# EAGLE design ECE4180_DP_Main (EAGLE 9.2.2)
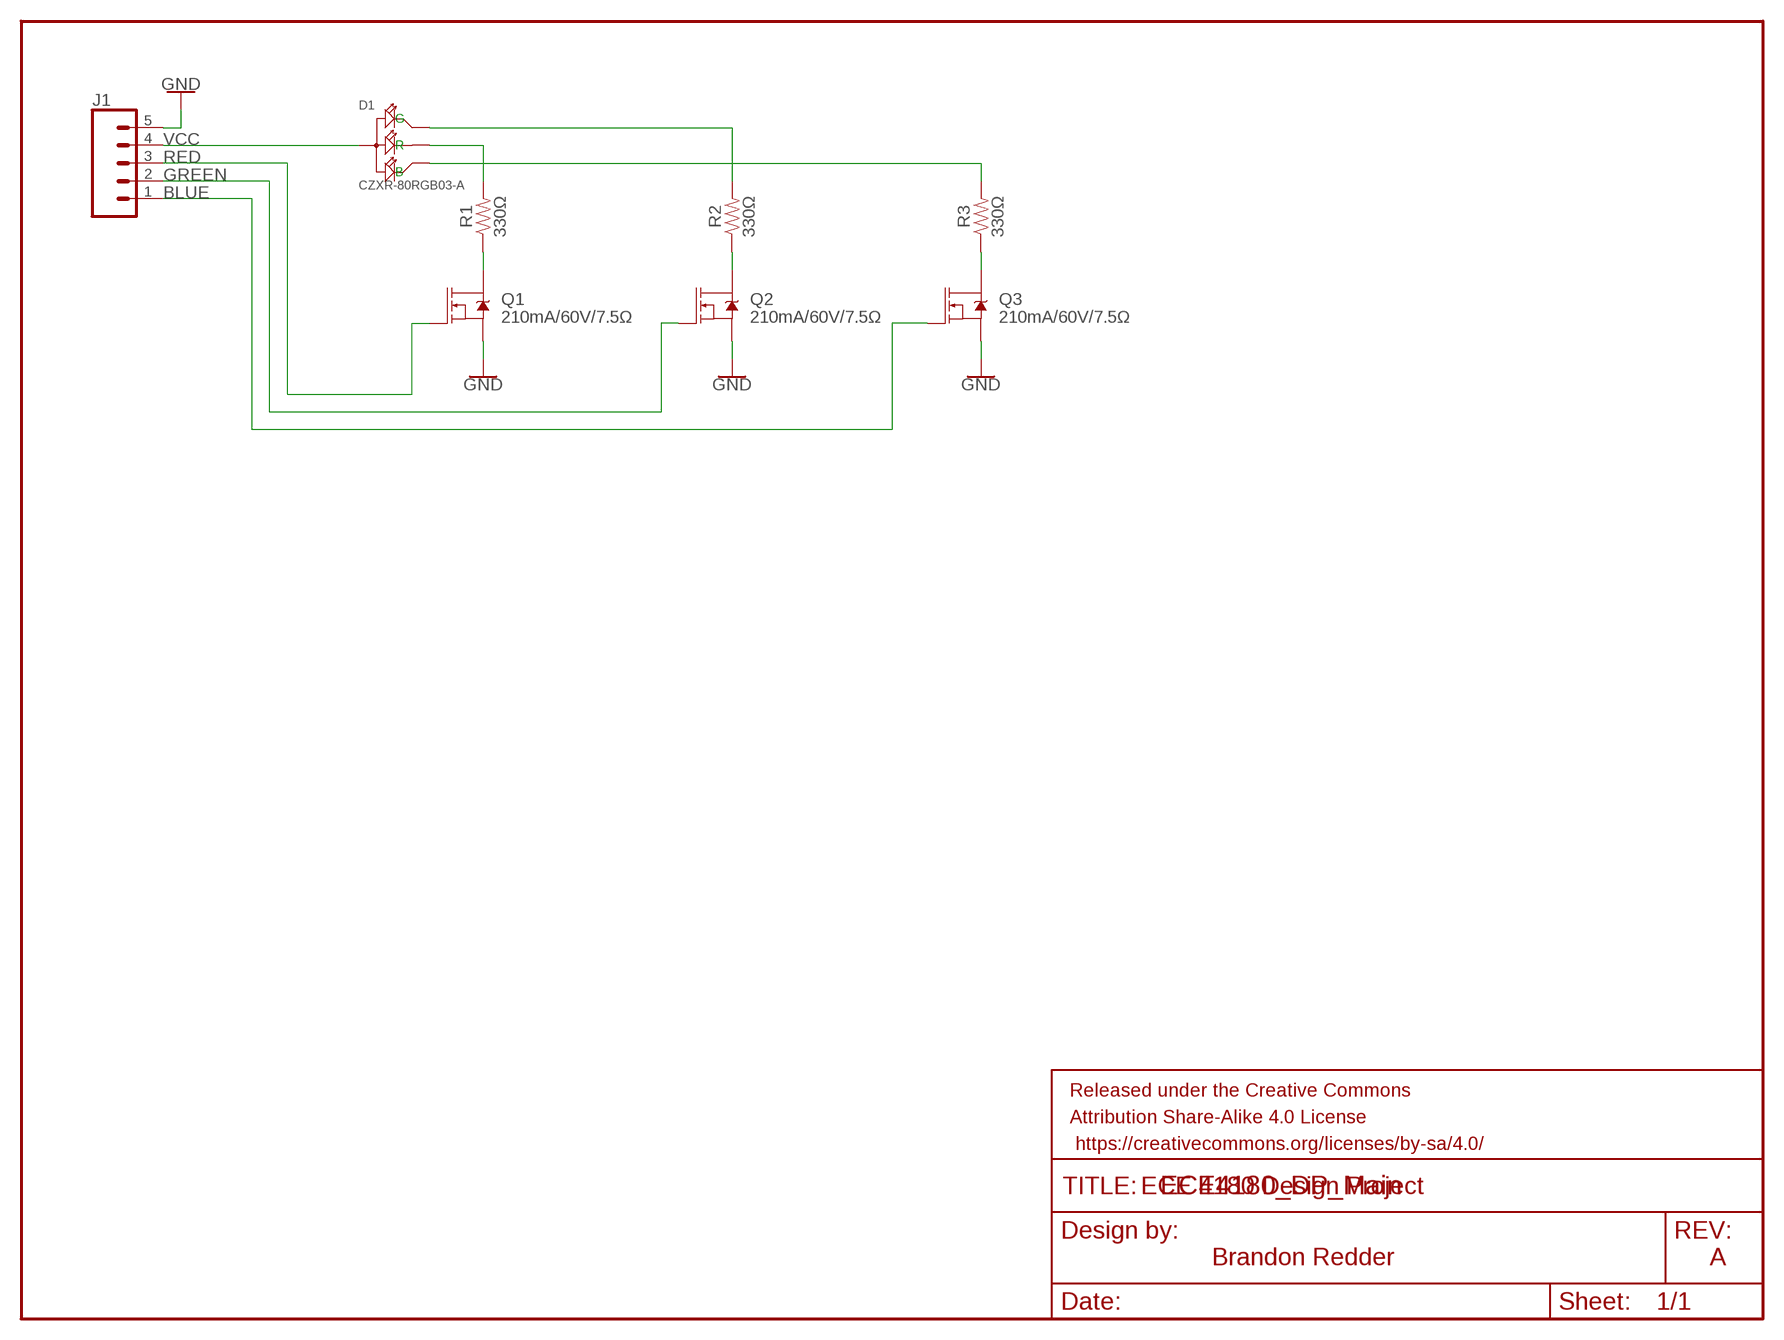
[diagram p0: schematic, sheet 1]

## Parts
D1  CZXR-80RGB03-A  DIP-LED-RGB-COMMON-ANODE(4P-D8MM)  [LED4-2.0-D8.0MM]
FRAME  FRAME-LETTERNO_PACKAGE  [DUMMY]
J1  CONN_05LOCK  [1X05_LOCK]
Q1  210mA/60V/7.5Ω  MOSFET-NCH-AO3404A  [SOT23-3]
Q2  210mA/60V/7.5Ω  MOSFET-NCH-AO3404A  [SOT23-3]
Q3  210mA/60V/7.5Ω  MOSFET-NCH-AO3404A  [SOT23-3]
R1  330Ω  RESISTOR0805  [0805]
R2  330Ω  RESISTOR0805  [0805]
R3  330Ω  RESISTOR0805  [0805]

## Nets
BLUE: J1.1 Q3.1(G)
GND: J1.5 Q1.2(S) Q2.2(S) Q3.2(S)
GREEN: J1.2 Q2.1(G)
N$1: D1.1(R) R1.2
N$2: D1.4(B) R3.2
N$3: D1.3(G) R2.2
N$4: Q1.3(D) R1.1
N$5: Q2.3(D) R2.1
N$6: Q3.3(D) R3.1
RED: J1.3 Q1.1(G)
VCC: D1.2(+) J1.4

## Notes on the sheet
- ECE 4180 Design Project
- Brandon Redder | A

## Library data of the parts
D1 = Seeed-LED:DIP-LED-RGB-COMMON-ANODE(4P-D8MM): 304090065; MPN: CZXR-80RGB03-A
FRAME = SparkFun-Aesthetics:FRAME-LETTER: Schematic Frame - Letter Standard 8.5x11 US Letter frame; DESIGNER: Brandon Redder; VERSION: v01
J1 = SparkFun-Connectors:CONN_05: Multi connection point. Often used as Generic Header-pin footprint for 0.1 inch spaced/style header connections On any of the 0.1 inch spaced packages, you can populate with these: Break Away Headers - Straight <https://www.sparkfun.com/products/116> (PRT-00116) Break Away Male Headers - Right Angle <https://www.sparkfun.com/products/553> (PRT-00553) Female Headers <https://www.sparkfun.com/products/115> (PRT-00115) Break Away Headers - Machine Pin <https://www.sparkfun.com/products/117> (PRT-00117) Break Away Female Headers - Swiss Machine Pin <https://www.sparkfun.com/products/743> (PRT-00743) For SCREWTERMINALS and SPRING TERMINALS visit here: Screw Terimnals on SparkFun.com <https://www.sparkfun.com/search/results?term=Screw+Terminals> (5mm/3.5mm/2.54mm spacing) This device is also useful as a general connection point to wire up your design to another part of your project. Our various solder wires solder well into these plated through hole pads. Hook-Up Wire - Assortment (Stranded, 22 AWG) <https://www.sparkfun.com/products/11375> (PRT-11375) Hook-Up Wire - Assortment (Solid Core, 22 AWG) <https://www.sparkfun.com/products/11367> (PRT-11367) View the entire wire category on our website here <https://www.sparkfun.com/categories/141> Special notes: Molex polarized connector foot print use with SKU : PRT-08231 with associated crimp pins and housings. 1MM SMD Version SKU: PRT-10208
Q1-Q3 = SparkFun-DiscreteSemi:MOSFET-NCH: N-channel MOSFETs Voltage controlled devices that allow control of high current outputs. SparkFun Products: SparkFun OpenScale <https://www.sparkfun.com/products/13261> SparkFun Digital Sandbox <https://www.sparkfun.com/products/12651> SparkFun Monster Moto Shield <https://www.sparkfun.com/products/10182> SparkFun MOSFET Power Controller <https://www.sparkfun.com/products/11214>; PROD_ID: TRANS-12988; VALUE: 5.8A/30V/35mΩ
R1-R3 = SparkFun-Resistors:RESISTOR: Generic Resistor Package

## Board
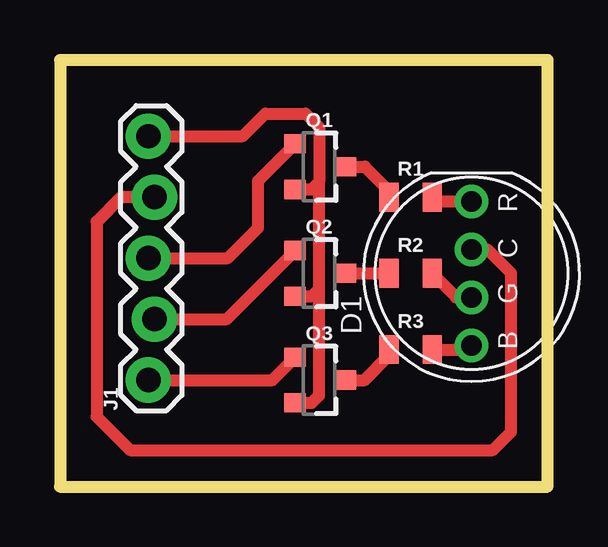
[diagram p1: board, top side]

Size 20.32 x 17.78 mm. Coordinates in mm from the lower left corner, seen from the top.
Outline: 20.32,0 20.3,1.27
Outline: 20.32,0 0,0 0,17.78 20.32,17.78 20.32,0
Copper layers (1*16): Top 0.035mm / dielectric 1.5mm / Bottom 0.035mm
Design rules "default": minimum track width 6mil, minimum drill 0.35mm, track to track 6mil, track to pad 6mil, pad to pad 6mil, via to via 6mil, smd to smd 6mil, copper to edge 40mil, drill to drill 6mil, minimum pad ring 10mil, minimum via ring 8mil, stop-mask expansion 4mil, vias tented up to drill 0mil, thermal gap 10mil

### Footprints (pad centres in the part's own frame; a part is rotated, then mirrored left to right if it is on the bottom)
LED4-2.0-D8.0MM = drill 0.85 pad 1.4: 1 3,0; 2 1,0; 3 -1,0; 4 -3,0
1X05_LOCK = drill 1.016 pad 1.88: 1 0,0.127; 2 2.54,-0.127; 3 5.08,0.127; 4 7.62,-0.127; 5 10.16,0.127
SOT23-3 = smd 0.8 x 0.9: 1 -0.95,-1; 2 0.95,-1; 3 0,1.1
0805 = smd 0.8 x 1.2: 1 -0.9,0; 2 0.9,0

### Placement (x,y rotation side)
D1  17.14,8.89 90 top
FRAME  29.21,33.02 0 top  (outside the outline)
J1  3.81,4.45 90 top
Q1  10.79,13.33 270 top
Q2  10.79,8.89 270 top
Q3  10.79,4.45 270 top
R1  14.61,12.06 0 top
R2  14.61,8.89 0 top
R3  14.61,5.71 0 top

### Tracks (layer width: path | path; a pad name or v marks a point on that pad's centre or on a via)
BLUE
  Top 0.508: J1.1 8.85,4.45 Q3.1
GND
  Top 0.508: Q3.2 10.48,3.5 10.79,3.81 10.79,8.26 | 10.79,8.26 10.79,12.7 | 10.79,12.7 10.79,14.99 10.24,15.54 8.56,15.54 7.62,14.61 J1.5 | Q1.2 10.48,12.38 10.79,12.7 | Q2.2 10.48,7.94 10.79,8.26
GREEN
  Top 0.508: J1.2 6.94,6.98 Q2.1
N$1
  Top 0.508: R1.2 15.68,11.89 D1.1
N$2
  Top 0.508: R3.2 16.97,5.71 D1.4
N$3
  Top 0.508: R2.2 16.5,7.89 D1.3
N$4
  Top 0.508: Q1.3 12.7,13.33 13.71,12.33 R1.1
N$5
  Top 0.508: Q2.3 R2.1
N$6
  Top 0.508: Q3.3 12.7,4.45 13.71,5.45 R3.1
RED
  Top 0.508: J1.3 6.99,9.53 8.26,10.79 8.26,12.74 Q1.1
VCC
  Top 0.508: J1.4 2.54,12.06 1.52,11.05 1.52,2.92 2.92,1.52 18.03,1.52 18.8,2.29 18.8,8.89 17.8,9.89 D1.2